# Altium schematic sheet current_meter_remaster1.SchDoc
size B; SheetNumber: 1; SheetTotal: 1
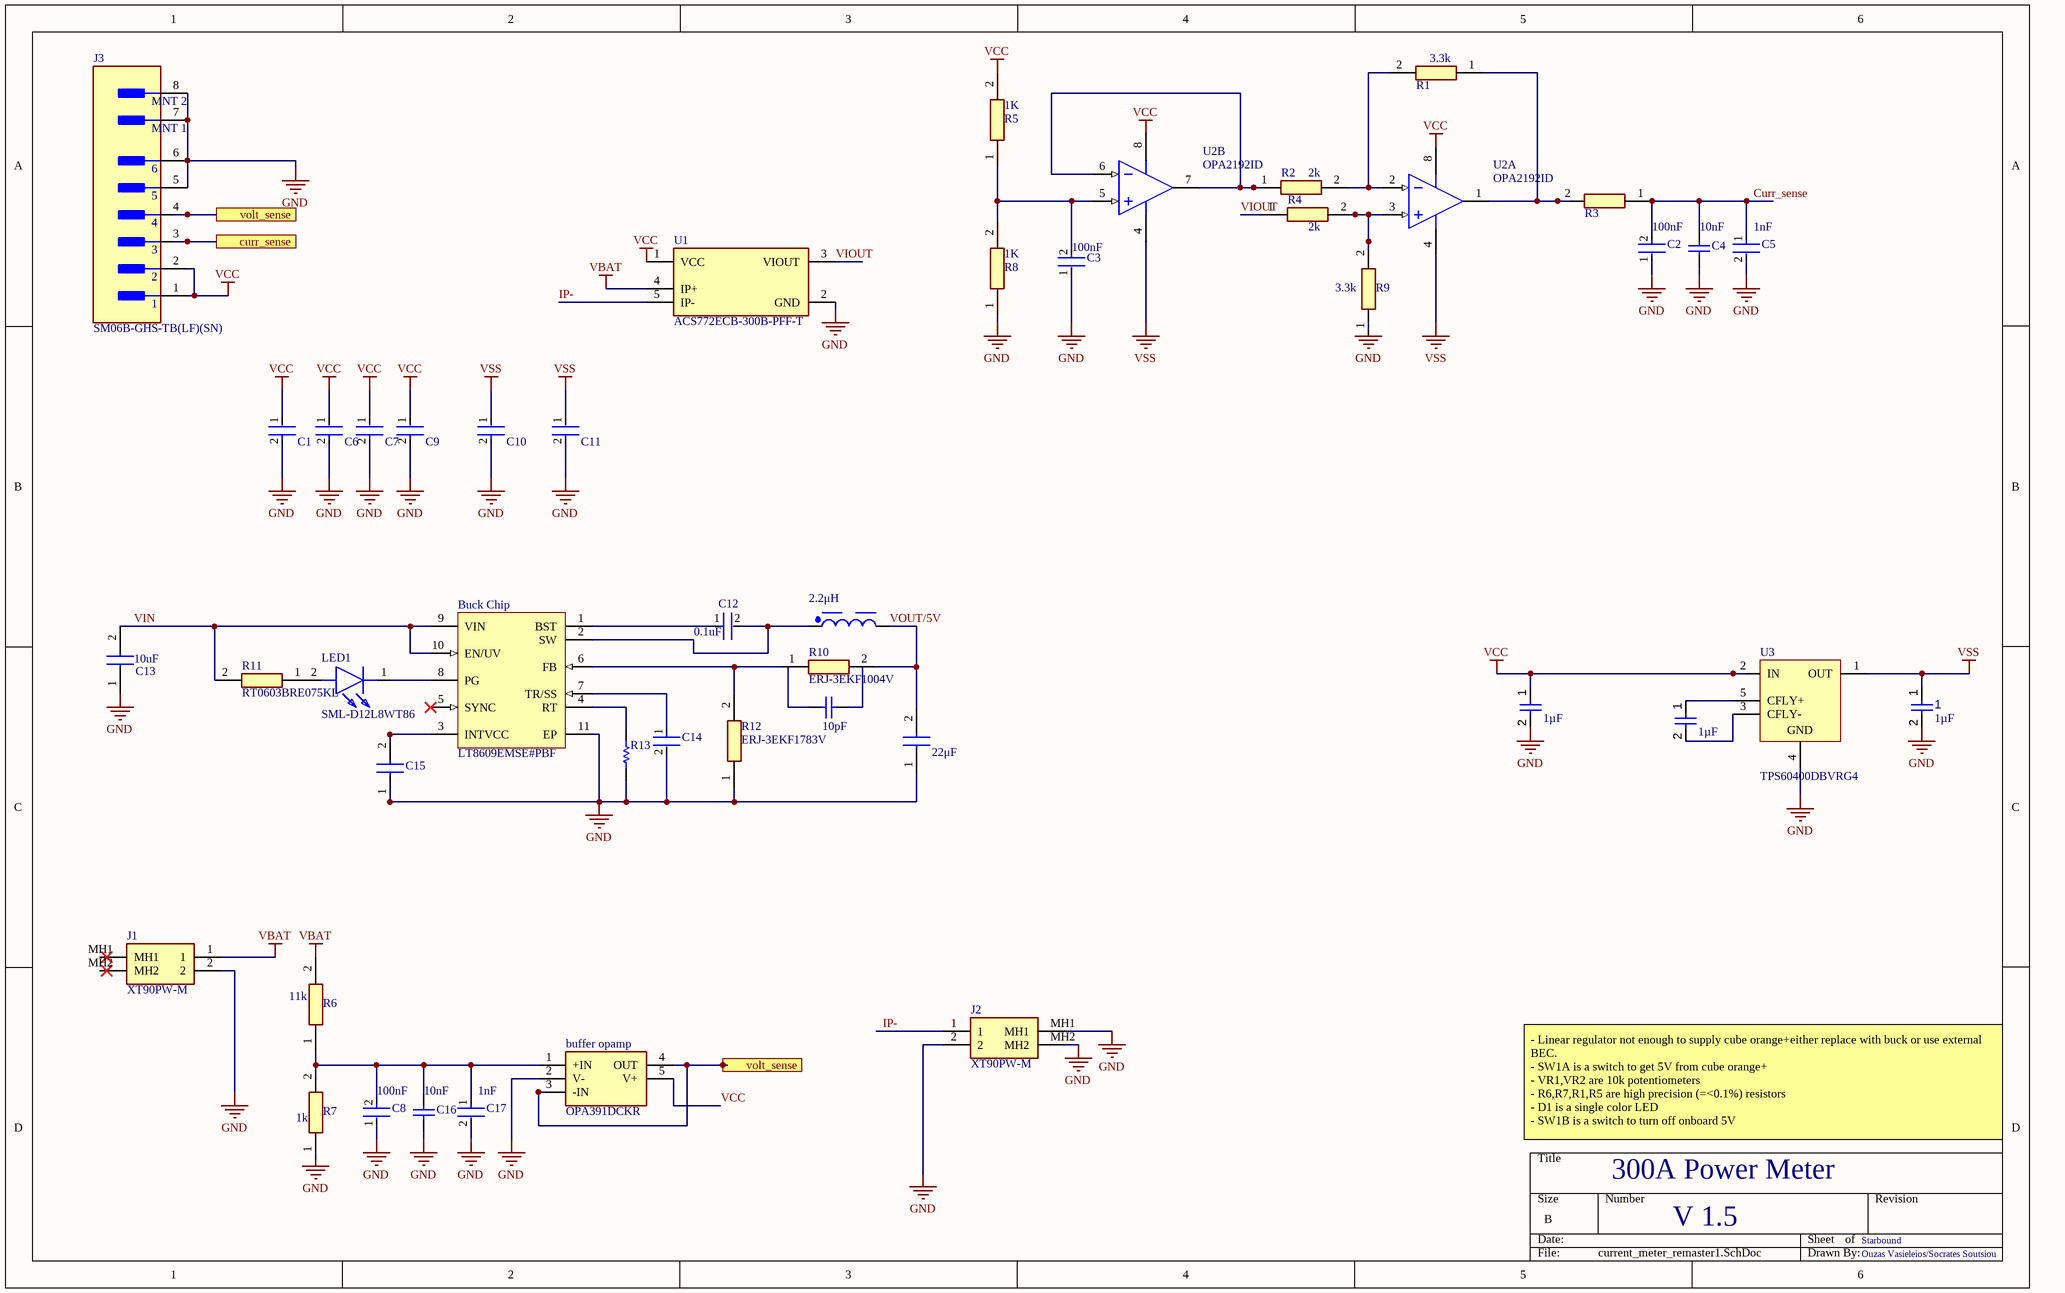
[diagram p0: current_meter_remaster1.SchDoc]

## Parts
(Parts that share a designator on the sheet are numbered #1, #2 ... from top to bottom, then left to right.)
1  value 1µF  [CAPC2013X135X45NL10T25]  (hidden comment: Capacitor 1 uF +/- 10% 50 V 0805)
2.2μΗ  74437346022  [WE-LHMI_7030]  (value not drawn)
10pF  GRM1885C1H100JA01D  [CAPC1608X90X35LL10T15]  (value not drawn)
22μF  GRM21BE70G226ME51L  [CAPC2012X145N]  (value not drawn)
?#1  value 1µF  [CAPC2013X135X45NL10T25]  (hidden comment: Capacitor 1 uF +/- 10% 50 V 0805)
?#2  value 1µF  [CAPC2013X135X45NL10T25]  (hidden comment: Capacitor 1 uF +/- 10% 50 V 0805)
Buck_Chip  LT8609EMSE#PBF  [LT-LT8609-MSE-10_V]
buffer_opamp  OPA391DCKR  [SOT65P210X110-5N]
C1  GRT033C81A104KE01J  [FP-GRT033-0_03-IPC_C]  (value not drawn)
C2  GRT033C81A104KE01J  [FP-GRT033-0_03-IPC_C]  (value not drawn)
C3  GRT033C81A104KE01J  [FP-GRT033-0_03-IPC_C]  (value not drawn)
C4  GRM188R71H103KA01D  [CAPC1608X90X35ML10T15]  (value not drawn)
C5  GRM1885C1H102JA01D  [FP-GRM188-0_1-e0_2_0_5-IPC_C]  (value not drawn)
C6  GRT033C81A104KE01J  [FP-GRT033-0_03-IPC_C]  (value not drawn)
C7  GRT033C81A104KE01J  [FP-GRT033-0_03-IPC_C]  (value not drawn)
C8  GRT033C81A104KE01J  [FP-GRT033-0_03-IPC_C]  (value not drawn)
C9  GRT033C81A104KE01J  [FP-GRT033-0_03-IPC_C]  (value not drawn)
C10  GRT033C81A104KE01J  [FP-GRT033-0_03-IPC_C]  (value not drawn)
C11  GRT033C81A104KE01J  [FP-GRT033-0_03-IPC_C]  (value not drawn)
C12  CC0603KRX7R9BB104  [FP-CC0603-DA-MFG]  (value not drawn)
C13  MCASU32MAB7106KPNA1J  [CAPC3225X280N]  (value not drawn)
C14  C0603C103K5RACTU  [FP-C0603C-CF-MFG]  (value not drawn)
C15  GRM188R61C105KA12J  [CAPC1608X90N]  (value not drawn)
C16  GRM188R71H103KA01D  [CAPC1608X90X35ML10T15]  (value not drawn)
C17  GRM1885C1H102JA01D  [FP-GRM188-0_1-e0_2_0_5-IPC_C]  (value not drawn)
J1  XT90PW-M  [XT90PWM]
J2  XT90PW-M  [XT90PWM]
J3  SM06B-GHS-TB(LF)(SN)  [FP-SM06B-GHS-TB_LF_SN-MFG]
LED1  SML-D12L8WT86  [SMLD12L8WT86]
R1  RG2012L-332-L-T05  [RESC2012X50N]  (value not drawn)
R2  ERJ-PC3B2001V  [ERJPC3D9763V]  (value not drawn)
R3  MCA1206MD1001BP100  [RESC3216X65N]  (value not drawn)
R4  ERJ-PC3B2001V  [ERJPC3D9763V]  (value not drawn)
R5  MCA1206MD1001BP100  [RESC3216X65N]  (value not drawn)
R6  ERA-6ARB113V  [ERA6AEB101V]  (value not drawn)
R7  MCA1206MD1001BP100  [RESC3216X65N]  (value not drawn)
R8  MCA1206MD1001BP100  [RESC3216X65N]  (value not drawn)
R9  RG2012L-332-L-T05  [RESC2012X50N]  (value not drawn)
R10  ERJ-3EKF1004V  [RESC1608X55N]
R11  RT0603BRE075KL  [RESC1608X55N]
R12  ERJ-3EKF1783V  [RESC1608X55N]
R13  RK73H1ETTP1622F  [RESC1005X40X25LL10T10]  (value not drawn)
U1  ACS772ECB-300B-PFF-T  [FP-CB-5-PFF-MFG]
U2  OPA2192ID  [D0008A_M]  (parts A,B of 2)
U3  TPS60400DBVRG4  [TI-DBV5_L]

## Ports
curr_sense (see current_meter[4B]), volt_sense (see current_meter[1A]), volt_sense (see current_meter[2C])

## Nets
GND: 1.2 22μF.1 ?#1.2 Buck_Chip.11(EP) buffer_opamp.2(V-) C1.2 C2.1 C3.1 C4.1 C5.2 C6.2 C7.2 C8.1 C9.2 C10.2 C11.2 C13.1 C14.2 C15.1 C16.1 C17.2 J1.2 J2.2 J2.MH1 J2.MH2 J3.5 J3.6 J3.7(MNT_1) J3.8(MNT_2) R7.1 R8.1 R12.1 R13.1 U1.2(GND) U3.4(GND)
VBAT: J1.1 R6.2 U1.4(IP+)
VCC: ?#1.1 buffer_opamp.5(V+) C1.1 C6.1 C7.1 C9.1 J3.1 J3.2 R5.2 U1.1(VCC) U2.8(V+) U3.2(IN)
VSS: 1.1 C10.1 C11.1 U2.4(V-) U3.1(OUT)
curr_sense: J3.3 ; port curr_sense
Curr_sense: C2.2 C4.2 C5.1 R3.1  [a separate net that carries the same name]
IP-: J2.1 U1.5(IP-)
VIN: Buck_Chip.9(VIN) Buck_Chip.10(EN/UV) C13.2 R11.2
VIOUT: R4.1 U1.3(VIOUT)
volt_sense: buffer_opamp.3(-IN) buffer_opamp.4(OUT) J3.4 ; port volt_sense
VOUT/5V: 2.2μΗ.2 22μF.2 R10.2
Net2.2μΗ_1: 2.2μΗ.1 Buck_Chip.2(SW) C12.2
Net?#2_1: ?#2.1 U3.5(CFLY+)
Net?#2_2: ?#2.2 U3.3(CFLY-)
NetBuck_Chip_1: Buck_Chip.1(BST) C12.1
NetBuck_Chip_3: Buck_Chip.3(INTVCC) C15.2
NetBuck_Chip_4: Buck_Chip.4(RT) R13.2
NetBuck_Chip_6: Buck_Chip.6(FB) R10.1 R12.2
NetBuck_Chip_7: Buck_Chip.7(TR/SS) C14.1
NetBuck_Chip_8: Buck_Chip.8(PG) LED1.1(K)
Netbuffer_opamp_1: buffer_opamp.1(+IN) C8.2 C16.2 C17.1 R6.1 R7.2
NetC3_2: C3.2 R5.1 R8.2 U2.5(IN_B+)
NetLED1_2: LED1.2(A) R11.1
NetR1_1: R1.1 R3.2 U2.1(OUT_A)
NetR1_2: R1.2 R2.2 U2.2(IN_A-)
NetR2_1: R2.1 U2.6(IN_B-) U2.7(OUT_B)
NetR4_2: R4.2 R9.2 U2.3(IN_A+)

Not connected (* = marked no-connect by the designer): 10pF 1 2; Buck_Chip 5(SYNC)*; J1 MH1 MH2; R9 1

## Notes on the sheet
- (near R1) 3.3k
- (near R5) 1K
- (near R2) 2k
- (near R4) 2k
- 100nF
- (near C4) 10nF
- (near C5) 1nF
- (near R8) 1K
- (near C3) 100nF
- (near R9) 3.3k
- (near C12) 0.1uF
- (near C13) 10uF
- (near R6) 11k
- (near C16) 10nF
- (near C17) 1nF
- (near R7) 1k
- - Linear regulator not enough to supply cube orange+either replace with buck or use external BEC.
  - SW1A is a switch to get 5V from cube orange+
  - VR1,VR2 are 10k potentiometers
  - R6,R7,R1,R5 are high precision (=<0.1%) resistors
  - D1 is a single color LED
  - SW1B is a switch to turn off onboard 5V
- 300A Power Meter
- V 1.5
- Starbound
- Ouzas Vasieleios/Socrates Soutsiou

## Library data of the parts
1 ?#1 ?#2 = CMP-001-00007-6: Chip Capacitor, 1 uF, +/- 10%, 50 V, 0805 (2012 Metric); Capacitor Type: Ceramic; Voltage Rating: 50V; Min Operating Temperature: -55°C; RoHS Compliant: True; Mounting Technology: SM; Case/Package: 0805; Max Operating Temperature: 125°C; Tolerance: 10%; Pins: 2
2.2μΗ = CMP-1353-00044-6: Inductor Power Shielded Wirewound 2.2uH 20% 100KHz Powdered Iron 6.5A 20mOhm DCR T/R; Inductance: 2.2µH; Self Resonant Frequency: 32MHz; Saturation Current: 10A; DC Resistance (DCR): 18mΩ; Width: 6.6mm; Length: 7.3mm; Height: 2.8mm; Ambient Temperature Range Low: -40°C; RoHS: Compliant; Min Operating Temperature: -40°C; Inductance Tolerance: 20%; Max Operating Temperature: 125°C; Ambient Temperature Range High: 85°C
10pF = CMP-2006-02592-1: Manufacturer: Murata; Part Number: GRM1885C1H100JA01D
22μF = GRM21BE70G226ME51L: Capacitor; Manufacturer_Name: Murata Electronics; Datasheet Link: https://search.murata.co.jp/Ceramy/image/img/A01X/G101/ENG/GRM21BE70G226ME51-01A.pdf; Height: 1.45mm; Manufacturer_Part_Number: GRM21BE70G226ME51L; Mouser Part Number: 81-GRM21BE70G226ME1L; Mouser Price/Stock: https://www.mouser.co.uk/ProductDetail/Murata-Electronics/GRM21BE70G226ME51L?qs=h0WOCFF19UI%252BhaCiyylbSQ%3D%3D; Arrow Part Number: GRM21BE70G226ME51L; Arrow Price/Stock: https://www.arrow.com/en/products/grm21be70g226me51l/murata-manufacturing?region=nac
Buck_Chip = CMP-2000-05200-1: 2 A / 3 A Peak Synchronous Step-Down Regulator with 2.5 uA Quiescent Current, 3 to 42 V, -40 to 125 degC, 10-Pin SOP (MSE-10-EDP), Pb-Free; Manufacturer: Linear Technology; Synchronous Rectifier: Yes; Topology: Buck; Voltage - Output (Max): 42V; Number of Outputs: 1; Current - Output: 2A; Voltage - Input (Min): 3V; Output Configuration: Positive; Voltage - Output (Min/Fixed): 0.782V; Frequency - Switching: 200kHz~2.2MHz; Output Type: Adjustable; Datasheet Version: Rev. A, 01/2016; Package / Case: 10-TFSOP,10-MSOP(0.118",3.00mmWidth)ExposedPad; Mounting Type: SurfaceMount; Packaging: Tube; Datasheet URL: http://cds.linear.com/docs/en/datasheet/8609fa.pdf; Series: -; Family: PMIC-VoltageRegulators-DCDCSwitchingRegulators; Manufacturer URL: http://www.linear.com/; Supplier Device Package: 10-MSOP-EP; Function: Step-Down; Operating Temperature: -40degC~125degC(TJ); Category: IntegratedCircuits(ICs); Voltage - Input (Max): 42V
buffer_opamp = OPA391DCKR: Integrated Circuit; Manufacturer_Name: Texas Instruments; Datasheet Link: https://www.ti.com/lit/ds/symlink/opa391.pdf?ts=1613652220116&ref_url=https%253A%252F%252Fwww.ti.com%252Fproduct%252FOPA391%253Fjktype%253Dhomepageproduct; Height: 1.1mm; Manufacturer_Part_Number: OPA391DCKR; Mouser Part Number: 595-OPA391DCKR; Mouser Price/Stock: https://www.mouser.co.uk/ProductDetail/Texas-Instruments/OPA391DCKR?qs=CiayqK2gdcK0KZT3BcNOuw%3D%3D; Arrow Part Number: OPA391DCKR; Arrow Price/Stock: https://www.arrow.com/en/products/opa391dckr/texas-instruments.html?utm_currency=USD&region=nac
C1-C3 C6-C11 = CMP-06035-053209-1: Multi-Layer Ceramic Capacitor 100nF 10V X6S ±10% 0201 Paper T/R
C4 C16 = CMP-2100-03642-1: Chip Capacitor, 10 nF, +/- 10%, 50 V, -55 to 125 degC, 0603 (1608 Metric), RoHS, Tape and Reel; Manufacturer: Murata; Insulation Resistance: 10GR; Dielectric: X7R; Voltage Rating: 50V; Capacitance: 10nF; Material: Ceramic; Package Quantity: 1; Lead Free: LeadFree; Case/Package: 0603; Termination: SMD/SMT; REACH SVHC: Unknown; Manufacturer URL: http://www.murata.com/; Datasheet URL: http://search.murata.co.jp/Ceramy/image/img/A01X/G101/ENG/GRM188R71H103KA01-01.pdf; Mount: SurfaceMount; Datasheet Version: 42401.0; Number of Pins: 2; Length: 1.6mm; Voltage: 50V; Depth: 0.8mm; Tolerance: 10%; Min Operating Temperature: -55degC; Voltage Rating (DC): 50V; Max Operating Temperature: 125degC; Package Description: 2-Pin Surface Mount Device, Body 1.6 x 0.8 mm; RoHSCompliant: True; Case Code (Imperial): 0603; Width: 0.031inch; Case Code (Metric): 1608; Height: 0.8mm; Package Reference: 0603; Packaging: TapeandReel; Thickness: 0.035inch; Dielectric Material: Ceramic
C5 C17 = CMP-1662-00022-2: Chip Multilayer Ceramic Capacitors for General Purpose, 0603, 1000pF, C0G, 30ppm/°C, 5%, 50V; Insulation Resistance: 10GR; Capacitance: 1nF; Number of Pins: 2; REACH SVHC: No SVHC; Width: 0.8mm; Tolerance: 5%; Termination: SMD/SMT; Thickness: 0.035inch; Height: 0.8mm; Case Code (Imperial): 0603; Length: 1.6mm; Voltage Rating: 50V; Voltage Rating (DC): 50V; Temperature Coefficient: 30ppm/°C; Mount: Surface Mount; Lead Free: Lead Free; Max Operating Temperature: 125°C; Min Operating Temperature: -55°C; Packaging: Tape and Reel; Dielectric: C0G; Voltage: 50V; Package Quantity: 1; Material: Ceramic; Case Code (Metric): 1608; Radiation Hardening: No; Depth: 0.8mm; Case/Package: 0603; Dielectric Material: Ceramic
C12 = CMP-2100-03601-2: CAP CER 0.1UF 50V X7R 0603; Manufacturer: YAGEO; Material: Ceramic; Capacitance: 100 nF; Temperature Coefficient: 15%; Tolerance: 0.1; Value: 100 nF; Description: CC0603 100 nF X7R 10.00% 50 V; Height: 0.9mm; Voltage: 50 V; ComponentLink2Description: Datasheet; Device Class L2: Capacitors; Temperature Range High: +125°C; Category: Cap; Footprint Url: http://www.yageo.com/exep/pages/download/literatures/UPY-C_GEN_24.pdf; ComponentLink2URL: http://www.yageo.com/documents/recent/UPY-GPHC_X7R_6.3V-to-50V_18.pdf; Package: CC0603-DA; Temperature: -55°C to +125°C; Voltage Rating: 50 V; Temperature Characteristic: X7R; Device Class L1: Passive Components; Temperature Range Low: -55°C; Manufacturer Part Number: CC0603KRX7R9BB104; RoHS: TRUE; Automotive: No; Device Class L3: Ceramic Capacitors; Octopart: https://octopart.com/cc0603krx7r9bb104-yageo-42244635; Mouser Description: Multilayer Ceramic Capacitor, CC Series, 0.1 - F, - 10%, X7R, 50 V, 0603 [1608 Metric]; Lead Free: Yes; Digikey Description: CAP CER 0.1UF 50V X7R 0603
C13 = MCASU32MAB7106KPNA1J: Capacitor; Manufacturer_Name: TAIYO YUDEN; Datasheet Link: https://ds.yuden.co.jp/TYCOMPAS/or/specSheet?pn=MCASU32MAB7106KPNA1J; Height: 2.8mm; Manufacturer_Part_Number: MCASU32MAB7106KPNA1J; Mouser Part Number: 963-U32MAB7106KPNA1J; Mouser Price/Stock: https://www.mouser.co.uk/ProductDetail/TAIYO-YUDEN/MCASU32MAB7106KPNA1J?qs=tlsG%2FOw5FFgDjQn5VUGpzA%3D%3D
C14 = CMP-2006-03046-3: CAP CER 10000PF 50V X7R 0603; Manufacturer: KEMET; Temperature Coefficient: 30ppm/°C; Capacitance: 10,000 pF; Automotive Grade: Grade 1; Material: Ceramic; Value: 10,000 pF; Tolerance: 0.1; Description: C0603 10,000 pF X7R 30ppm/°C 10.00% 50 V; Voltage Rating: 50 V; Digikey Description: CAP CER 10000PF 50V X7R 0603; ComponentLink2Description: Datasheet; Mouser Description: Ceramic Capacitor 0.01Uf, 50V, X7R, 10%, 0603, Full Reel; ComponentLink2URL: https://api.kemet.com/component-edge/download/datasheet/C0603C100J5GACAUTO.pdf; Package: C0603C-CF; RoHS: TRUE; Octopart: https://octopart.com/c0603c103k5ractu-kemet-133094; Device Class L1: Passive Components; Manufacturer Part Number: C0603C103K5RACTU; Temperature Range Low: -55°C; Automotive: Yes; Category: Cap; Lead Free: Yes; Temperature: -55°C to +125°C; Temperature Range High: +125°C; Temperature Characteristic: X7R; Height: 0.87mm; Device Class L3: Ceramic Capacitors; Device Class L2: Capacitors
C15 = GRM188R61C105KA12J: Capacitor; Manufacturer_Name: Murata Electronics; Datasheet Link: https://search.murata.co.jp/Ceramy/image/img/A01X/G101/ENG/GRM188R61C105KA12-02A.pdf; Height: 0.9mm; Manufacturer_Part_Number: GRM188R61C105KA12J; Mouser Part Number: 81-GRM188R61C105KA2J; Mouser Price/Stock: https://www.mouser.co.uk/ProductDetail/Murata-Electronics/GRM188R61C105KA12J?qs=giATsht9l5zorjRVstolWw%3D%3D; Arrow Part Number: GRM188R61C105KA12J; Arrow Price/Stock: https://www.arrow.com/en/products/grm188r61c105ka12j/murata-manufacturing
J1 J2 = XT90PW-M: Connector; Manufacturer_Name: Amass; Datasheet Link: https://www.tme.com/Document/7357a049cc8e5ea73e34d2124a313a81/XT90PW.pdf; Manufacturer_Part_Number: XT90PW-M
J3 = CMP-17439-000061-1: CONN HEADER SMD R/A 6POS 1.25MM; Number of Contacts: 6; Voltage Rating: 50V; Current Rating: 1A; Connector Type: Outer Shroud Contact; Contact Resistance: 50mR; Orientation: Right Angle; Max Operating Temperature: 85°C; Mount: Surface Mount; Packaging: Tape and Reel; Contact Plating: Tin; Depth: 4.05mm; Max Voltage Rating (AC): 50V; Lead Free: Lead Free; Pitch: 1.25mm; Number of Positions: 6; Max Current Rating: 1A; Termination: Solder; Min Operating Temperature: -25°C; Housing Color: Beige; Fastening Type: Ramp; Length: 10.75mm; Color: Natural; Contact Material: Bronze; Housing Material: Polyamide; Number of Rows: 1
LED1 = SML-D12L8WT86: LED; Manufacturer_Name: ROHM Semiconductor; Datasheet Link: https://fscdn.rohm.com/en/products/databook/datasheet/opto/led/chip_mono/sml-d12l8wt86-e.pdf; Height: 0.65mm; Manufacturer_Part_Number: SML-D12L8WT86; Mouser Part Number: 755-SML-D12L8WT86; Mouser Price/Stock: https://www.mouser.co.uk/ProductDetail/ROHM-Semiconductor/SML-D12L8WT86?qs=IPgv5n7u5QbFpmjN3v8AtQ%3D%3D
R1 R9 = RG2012L-332-L-T05: Resistor; Manufacturer_Name: Susumu; Datasheet Link: http://www.susumu.co.jp/common/pdf/RG_LL_Data_Sheet.pdf; Height: 0.5mm; Manufacturer_Part_Number: RG2012L-332-L-T05; Mouser Part Number: 754-RG2012L-332-LT05; Mouser Price/Stock: https://www.mouser.co.uk/ProductDetail/Susumu/RG2012L-332-L-T05?qs=FG09h9tFCuBorWjivIIY4g%3D%3D
R2 R4 = ERJ-PC3B2001V: Resistor 0.1%; Manufacturer_Name: Panasonic; Datasheet Link: https://industrial.panasonic.com/cdbs/www-data/pdf/RDM0000/ast-ind-394031.pdf; Height: 0.55mm; Manufacturer_Part_Number: ERJ-PC3B2001V
R3 R5 R7 R8 = MCA1206MD1001BP100: Resistor; Manufacturer_Name: Vishay; Datasheet Link: https://www.vishay.com/docs/28952/mcs0402at-mct0603at-mcu0805at-mca1206at.pdf; Height: 0.65mm; Manufacturer_Part_Number: MCA1206MD1001BP100; Mouser Part Number: 594-MCA1206MD1001BP1; Mouser Price/Stock: https://www.mouser.co.uk/ProductDetail/Vishay-Beyschlag/MCA1206MD1001BP100?qs=EzBFWPtgsb1yJX845JIydA%3D%3D
R6 = ERA-6ARB113V: Resistor 11k,0.1%; Manufacturer_Name: Panasonic; Datasheet Link: https://industrial.panasonic.com/cdbs/www-data/pdf/RDM0000/AOA0000C307.pdf; Height: 0.6mm; Manufacturer_Part_Number: ERA-6ARB113V; Mouser Part Number: 667-ERA-6ARB113V; Mouser Price/Stock: https://www.mouser.co.uk/ProductDetail/Panasonic/ERA-6ARB113V?qs=ob%252BdNz2%252BYEiUbZTtnMzKMg%3D%3D
R10 = ERJ-3EKF1004V: Resistor; Manufacturer_Name: Panasonic; Datasheet Link: http://industrial.panasonic.com/cdbs/www-data/pdf/RDA0000/AOA0000C86.pdf; Height: 0.55mm; Manufacturer_Part_Number: ERJ-3EKF1004V; Mouser Part Number: 667-ERJ-3EKF1004V; Mouser Price/Stock: https://www.mouser.co.uk/ProductDetail/Panasonic/ERJ-3EKF1004V?qs=6%252BUraArZVSCwybhfQn7iYg%3D%3D; Arrow Part Number: ERJ-3EKF1004V; Arrow Price/Stock: https://www.arrow.com/en/products/erj-3ekf1004v/panasonic?utm_currency=USD&region=nac
R11 = RT0603BRE075KL: Resistor; Manufacturer_Name: Yageo Group; Datasheet Link: https://www.yageo.com/upload/media/product/productsearch/datasheet/rchip/PYu-RT_1-to-0.01_RoHS_L_13.pdf; Height: 0.55mm; Manufacturer_Part_Number: RT0603BRE075KL; Mouser Part Number: 603-RT0603BRE075KL; Mouser Price/Stock: https://www.mouser.co.uk/ProductDetail/YAGEO/RT0603BRE075KL?qs=acBVhj9v9XV8K9glB49uvw%3D%3D; Arrow Part Number: RT0603BRE075KL; Arrow Price/Stock: https://www.arrow.com/en/products/rt0603bre075kl/yageo?utm_currency=USD&region=nac
R12 = ERJ-3EKF1783V: Resistor; Manufacturer_Name: Panasonic; Datasheet Link: http://industrial.panasonic.com/cdbs/www-data/pdf/RDA0000/AOA0000C86.pdf; Height: 0.55mm; Manufacturer_Part_Number: ERJ-3EKF1783V; Mouser Part Number: 667-ERJ-3EKF1783V; Mouser Price/Stock: https://www.mouser.com/Search/Refine.aspx?Keyword=667-ERJ-3EKF1783V; Arrow Part Number: ERJ-3EKF1783V; Arrow Price/Stock: https://www.arrow.com/en/products/erj-3ekf1783v/panasonic
R13 = CMP-2002-03872-1: Manufacturer: KOA Speer; Part Number: RK73H1ETTP1622F
U1 = CMP-82923-000130-3: Current Sensor Current Sensor AC/DC Current 5V Automotive 5-Pin Case CB-PFF Tube
U2 = CMP-0272-04158-2: Precision, Rail-to-Rail Input/Output, Low Offset Voltage, Low Input Bias Current Op Amp with E-trim, 4.5 to 36 V, -40 to 125 degC, 8-Pin SOIC (D), Green (RoHS & no Sb/Br), Tube; Channel: 2; VS Max: 36 V; Slew Rate: 20 V/us; VS Min: 4.5 V; Code_JEDEC: MS-012; RoHS: TRUE; ComponentLink3URL: http://www.ti.com/lit/ml/msoi002j/msoi002j.pdf; ComponentLink3Description: Package Specification; ComponentLink2Description: Datasheet; PackageVersion: 4040047-3/M, 06/2011; DatasheetVersion: SBOS620D; ComponentLink2URL: http://www.ti.com/lit/ds/symlink/opa2192.pdf; Temperature Max: 125 degC; Temperature Min: -40 degC; ComponentLink1Description: Manufacturer URL; Mounting Technology: Surface Mount; PackageReference: D0008A; PackageDescription: 8-Pin Plastic Small Outline, Body 4.9 x 3.9 mm, Pitch 1.27 mm; PartNumber: OPA2192ID; ComponentLink1URL: http://www.ti.com/; Packing: Tube
U3 = CMP-0391-00018-1: -1.8 to -5.25 V, Inverting Charge Pump, 60 mA, 1.8 to 5.25 V Input with 2-Cell Alkaline / Nixx Input, -40 to 85 degC, 5-pin SOT23 (DBV5), Green (RoHS & no Sb/Br); Manufacturer: Texas Instruments; Topology: Inverting Buck/Boost; Iout(Max)(A): 0.06; Vin(Max)(V): 5.25; Efficiency(Typ)(%): 99; 2-Cell Alkaline/Nixx Input: TRUE; Switching Frequency(Max)(kHz): 450; Vin(Min)(V): 1.8; Vout(Min)(V): -1.6; Iq(Typ)(mA): 0.125; Eco-Plan: Green (RoHS & no Sb/Br); ComponentLink2URL: http://www.ti.com/general/docs/lit/getliterature.tsp?genericPartNumber=TPS60400&fileType=pdf; ComponentLink3Description: Package Specification; PackageReference: DBV5; PackageVersion: 4073253-4/K; PackageDescription: 5-Pin Plastic Small Outline, Body 1.60 Ãƒâ€” 2.90 mm, Pitch 0.95 mm; DatasheetVersion: SLVS324A; PartNumber: TPS60400DBVRG4; ComponentLink3URL: http://www.ti.com/litv/pdf/mpds018i; ComponentLink1Description: Manufacturer URL; Vout(Max)(V): -5.25; ComponentLink1URL: http://www.ti.com/; Code_JEDEC: MO-178; Mounting Technology: Surface Mount; ComponentLink2Description: Datasheet